# EAGLE design DME_Board_1 (EAGLE 7.2.0)
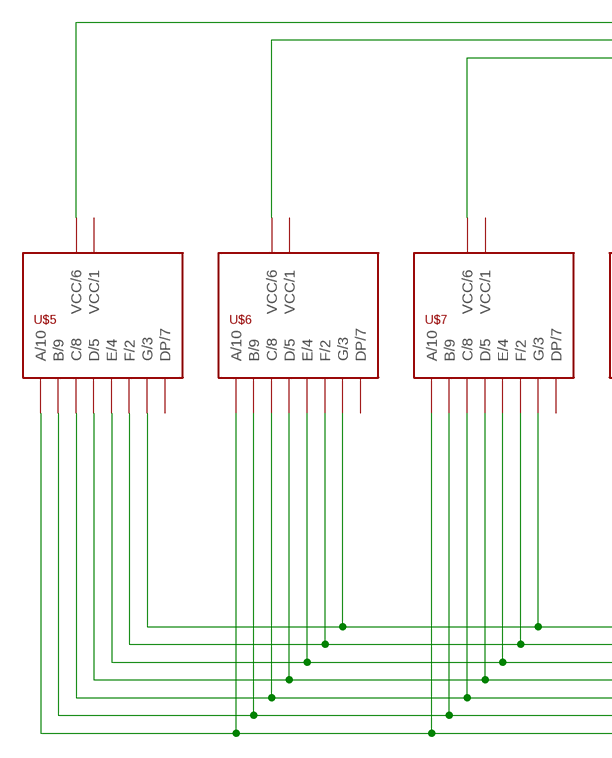
[diagram p0: schematic, sheet 1, part 1 of 2]
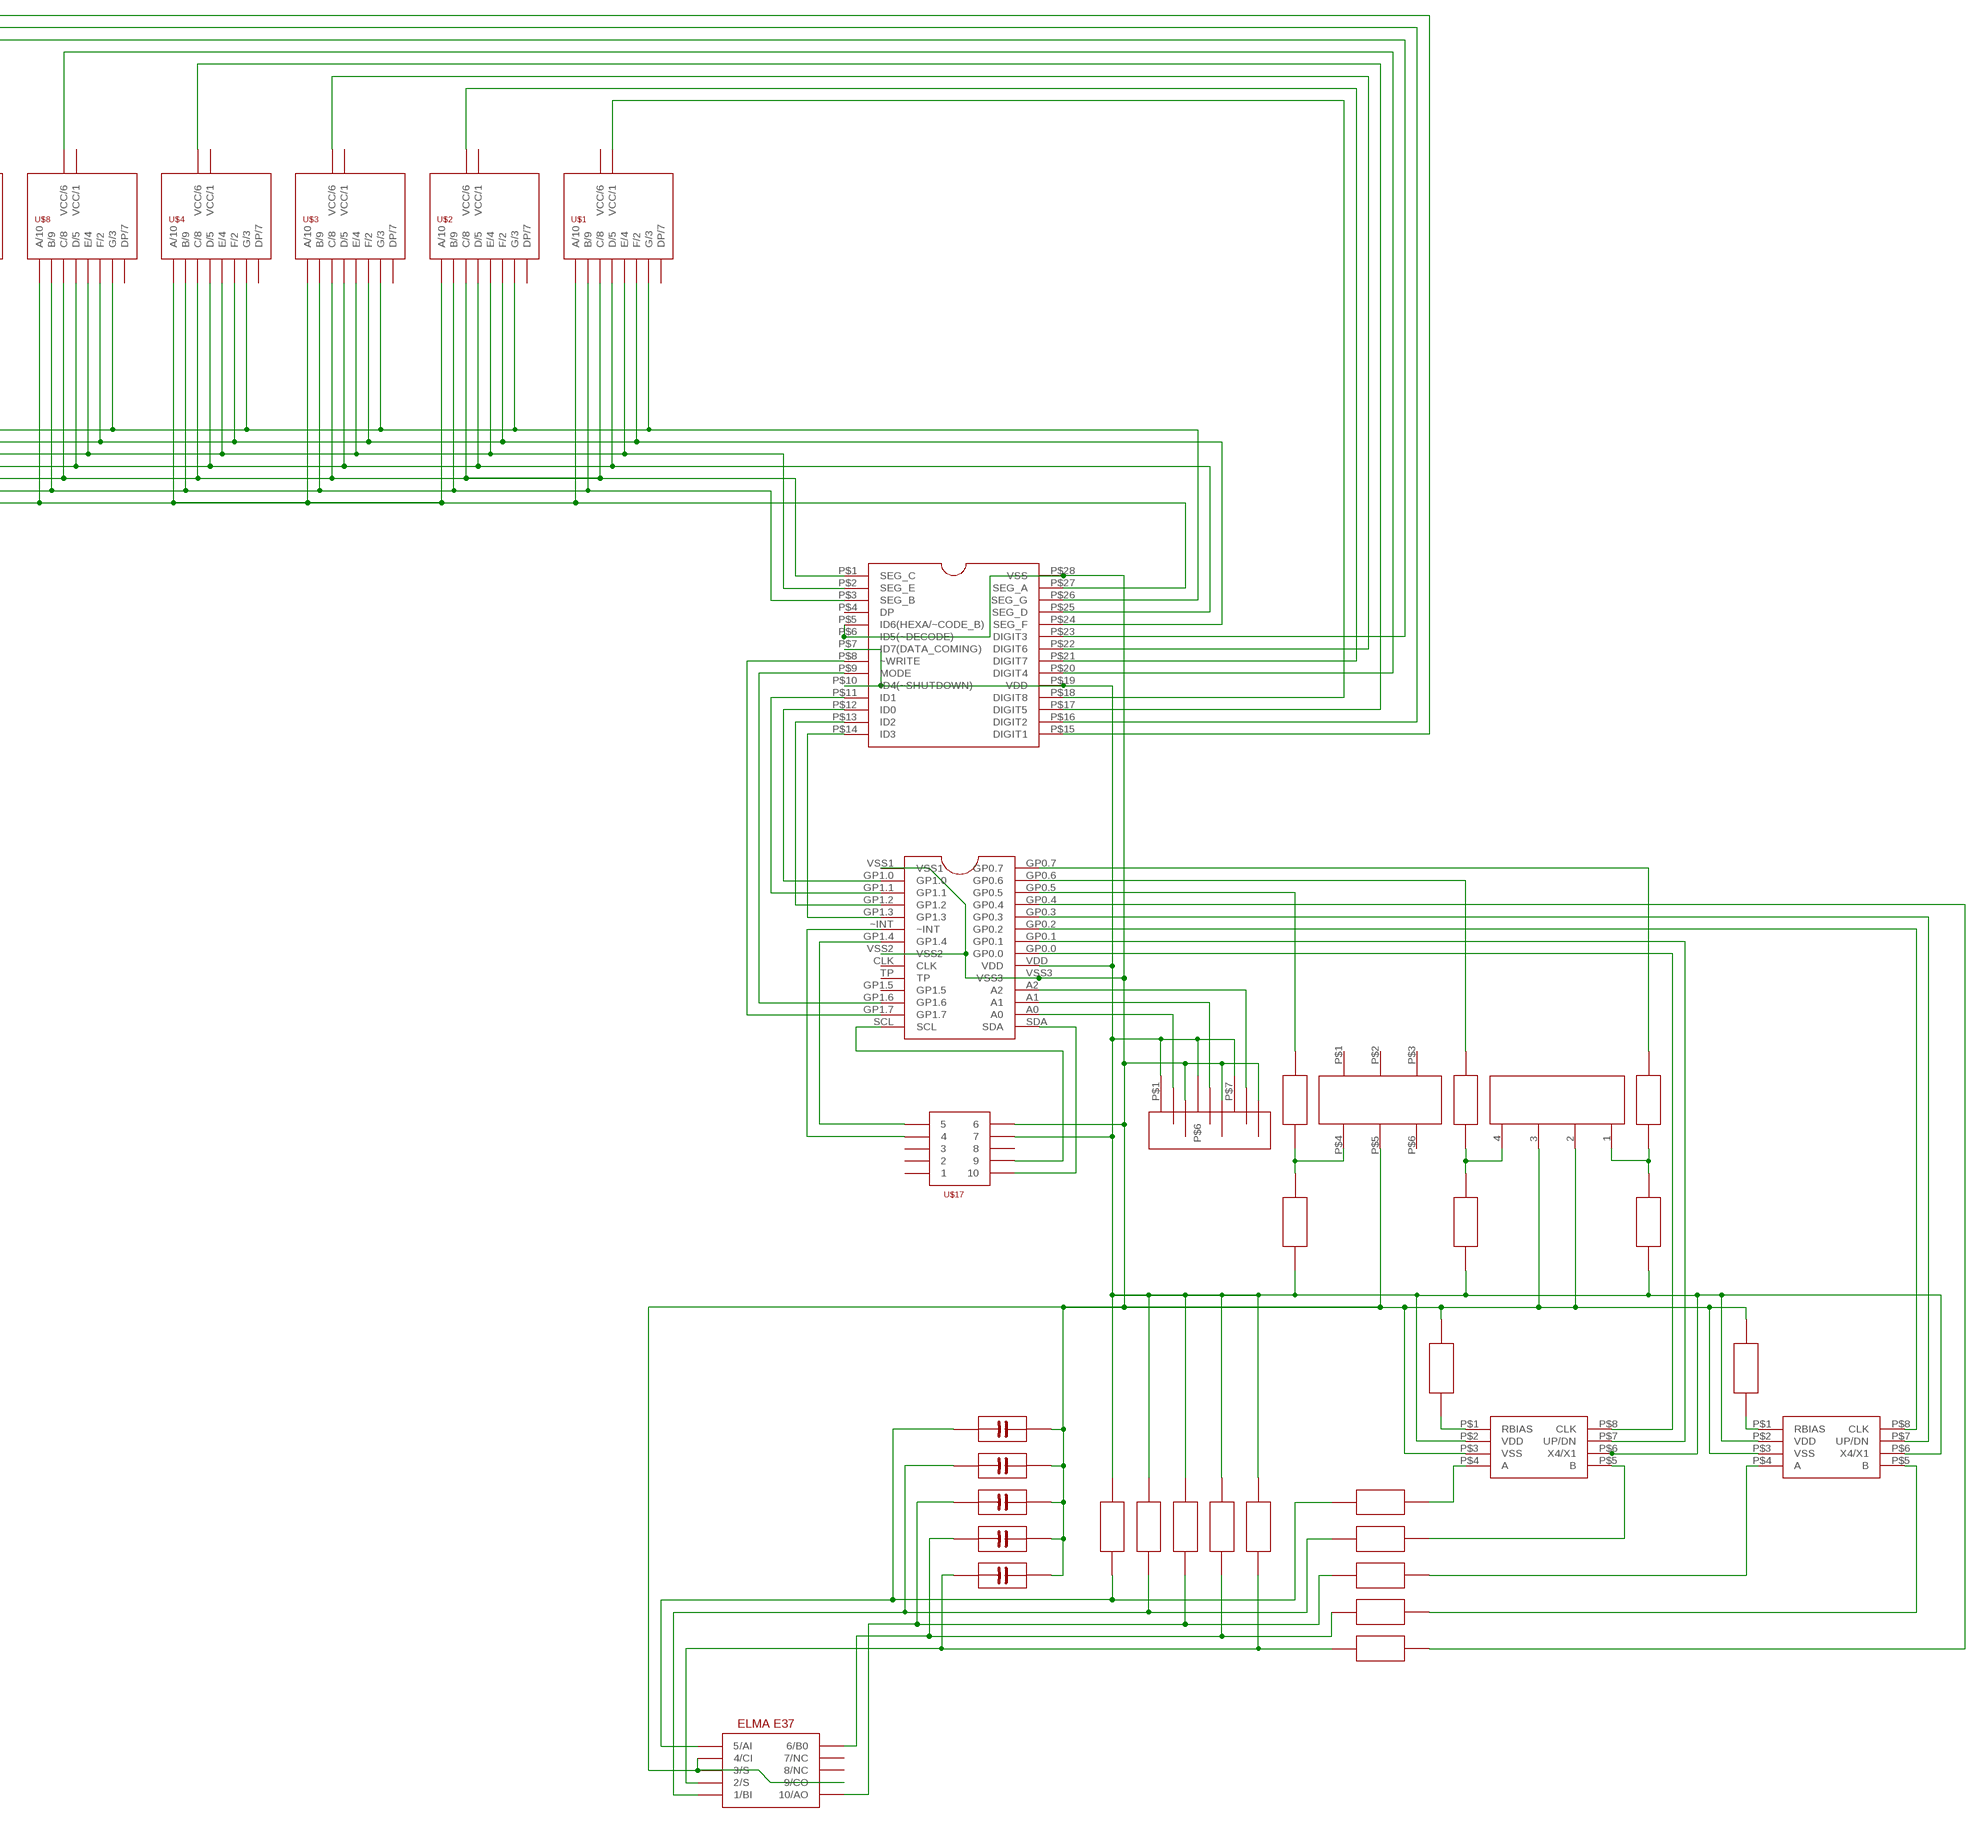
[diagram p1: schematic, sheet 1, part 2 of 2]

## Parts
U$1  SA3611EWA  [SA3611EWA]
U$2  SA3611EWA  [SA3611EWA]
U$3  SA3611EWA  [SA3611EWA]
U$4  SA3611EWA  [SA3611EWA]
U$5  SA3611EWA  [SA3611EWA]
U$6  SA3611EWA  [SA3611EWA]
U$7  SA3611EWA  [SA3611EWA]
U$8  SA3611EWA  [SA3611EWA]
U$9  ELMA_E37  [ELMA_E37]
U$10  REZISTOR  [REZISTOR]
U$11  KONDENZATOR  [KONDENZATOR]
U$12  T220  [T220]
U$13  REZISTOR  [REZISTOR]
U$14  ICM7228A  [ICM7228A]
U$15  REZISTOR  [REZISTOR]
U$16  MCP23016  [MCP23016]
U$17  LISTA_2X5  [LISTA_2X5]
U$18  LS7084  [LS7084]
U$19  46311LD  [46311LD]
U$20  REZISTOR  [REZISTOR]
U$21  REZISTOR  [REZISTOR]
U$22  REZISTOR  [REZISTOR]
U$23  REZISTOR  [REZISTOR]
U$24  ADRESA_0..2  [ADRESA_0..2]
U$25  REZISTOR  [REZISTOR]
U$26  REZISTOR  [REZISTOR]
U$27  REZISTOR  [REZISTOR]
U$28  REZISTOR  [REZISTOR]
U$29  REZISTOR  [REZISTOR]
U$30  REZISTOR  [REZISTOR]
U$31  REZISTOR  [REZISTOR]
U$32  REZISTOR  [REZISTOR]
U$33  REZISTOR  [REZISTOR]
U$34  REZISTOR  [REZISTOR]
U$35  REZISTOR  [REZISTOR]
U$42  KONDENZATOR  [KONDENZATOR]
U$43  KONDENZATOR  [KONDENZATOR]
U$44  KONDENZATOR  [KONDENZATOR]
U$45  103  KONDENZATOR  [KONDENZATOR]
U$46  LS7084  [LS7084]

## Nets
N$1: U$1.10(A/10) U$2.10(A/10) U$3.10(A/10) U$4.10(A/10) U$5.10(A/10) U$6.10(A/10) U$7.10(A/10) U$8.10(A/10) U$14.P$27(SEG_A)
N$2: U$1.9(B/9) U$2.9(B/9) U$3.9(B/9) U$4.9(B/9) U$5.9(B/9) U$6.9(B/9) U$7.9(B/9) U$8.9(B/9) U$14.P$3(SEG_B)
N$3: U$1.8(C/8) U$2.8(C/8) U$3.8(C/8) U$4.8(C/8) U$5.8(C/8) U$6.8(C/8) U$7.8(C/8) U$8.8(C/8) U$14.P$1(SEG_C)
N$4: U$1.5(D/5) U$2.5(D/5) U$3.5(D/5) U$4.5(D/5) U$5.5(D/5) U$6.5(D/5) U$7.5(D/5) U$8.5(D/5) U$14.P$25(SEG_D)
N$5: U$5.6(VCC/6) U$14.P$15(DIGIT1)
N$6: U$1.2(F/2) U$2.2(F/2) U$3.2(F/2) U$4.2(F/2) U$5.2(F/2) U$6.2(F/2) U$7.2(F/2) U$8.2(F/2) U$14.P$24(SEG_F)
N$7: U$1.3(G/3) U$2.3(G/3) U$3.3(G/3) U$4.3(G/3) U$5.3(G/3) U$6.3(G/3) U$7.3(G/3) U$8.3(G/3) U$14.P$26(SEG_G)
N$8: U$6.6(VCC/6) U$14.P$16(DIGIT2)
N$9: U$1.4(E/4) U$2.4(E/4) U$3.4(E/4) U$4.4(E/4) U$5.4(E/4) U$6.4(E/4) U$7.4(E/4) U$8.4(E/4) U$14.P$2(SEG_E)
N$10: U$7.6(VCC/6) U$14.P$23(DIGIT3)
N$11: U$8.6(VCC/6) U$14.P$20(DIGIT4)
N$12: U$1.1(VCC/1) U$14.P$18(DIGIT8)
N$13: U$2.6(VCC/6) U$14.P$21(DIGIT7)
N$14: U$3.6(VCC/6) U$14.P$22(DIGIT6)
N$15: U$4.6(VCC/6) U$14.P$17(DIGIT5)
N$16: U$16.GP0.5 U$23.P$2
N$17: U$9.1(1/BI) U$11.P$1 U$25.P$1 U$32.P$2
N$18: U$14.P$12(ID0) U$16.GP1.0
N$19: U$14.P$11(ID1) U$16.GP1.1
N$20: U$14.P$13(ID2) U$16.GP1.2
N$21: U$14.P$14(ID3) U$16.GP1.3
N$22: U$14.P$9(MODE) U$16.GP1.6
N$23: U$14.P$8(~WRITE) U$16.GP1.7
N$24: U$16.A0 U$24.P$2
N$25: U$10.P$1 U$13.P$1 U$14.P$7(ID7(DATA_COMING)) U$14.P$10(ID4(~SHUTDOWN)) U$14.P$19(VDD) U$15.P$1 U$16.VDD U$17.7 U$18.P$2(VDD) U$18.P$6(X4/X1) U$20.P$2 U$24.P$1 U$24.P$6 U$24.P$7 U$25.P$2 U$26.P$2 U$27.P$2 U$28.P$2 U$46.P$2(VDD) U$46.P$6(X4/X1)
N$26: U$31.P$1 U$46.P$4(A)
N$27: U$30.P$1 U$46.P$5(B)
N$28: U$9.10(10/AO) U$26.P$1 U$31.P$2 U$43.P$1
N$29: U$9.2(2/S) U$28.P$1 U$29.P$2 U$45.P$1
N$30: U$9.6(6/B0) U$27.P$1 U$30.P$2 U$44.P$1
N$31: U$16.GP0.4 U$29.P$1
N$32: U$18.P$4(A) U$33.P$1
N$33: U$16.A1 U$24.P$5
N$34: U$35.P$1 U$46.P$1(RBIAS)
N$35: U$18.P$5(B) U$32.P$1
N$36: U$18.P$1(RBIAS) U$34.P$1
N$37: U$16.GP0.1 U$18.P$7(UP/DN)
N$38: U$16.GP0.0 U$18.P$8(CLK)
N$39: U$16.GP0.3 U$46.P$7(UP/DN)
N$40: U$16.GP0.2 U$46.P$8(CLK)
N$41: U$9.5(5/AI) U$20.P$1 U$33.P$2 U$42.P$1
N$42: U$16.A2 U$24.P$8
N$43: U$10.P$2 U$12.P$4 U$23.P$1
N$44: U$9.3(3/S) U$9.4(4/CI) U$9.9(9/CO) U$11.P$2 U$12.P$5 U$14.P$5(ID6(HEXA/~CODE_B)) U$14.P$6(ID5(~DECODE)) U$14.P$28(VSS) U$16.VSS1 U$16.VSS2 U$16.VSS3 U$17.6 U$18.P$3(VSS) U$19.2 U$19.3 U$24.P$3 U$24.P$4 U$24.P$9 U$34.P$2 U$35.P$2 U$42.P$2 U$43.P$2 U$44.P$2 U$45.P$2 U$46.P$3(VSS)
N$45: U$13.P$2 U$19.4 U$22.P$1
N$46: U$15.P$2 U$19.1 U$21.P$1
N$47: U$16.GP0.6 U$22.P$2
N$48: U$16.GP0.7 U$21.P$2
N$49: U$16.SDA U$17.10
N$50: U$16.SCL U$17.9
N$51: U$16.GP1.4 U$17.5
N$52: U$16.~INT U$17.4
Unconnected: U$1.6(VCC/6) U$1.7(DP/7) U$2.1(VCC/1) U$2.7(DP/7) U$3.1(VCC/1) U$3.7(DP/7) U$4.1(VCC/1) U$4.7(DP/7) U$5.1(VCC/1) U$5.7(DP/7) U$6.1(VCC/1) U$6.7(DP/7) U$7.1(VCC/1) U$7.7(DP/7) U$8.1(VCC/1) U$8.7(DP/7) U$9.7(7/NC) U$9.8(8/NC) U$12.P$1 U$12.P$2 U$12.P$3 U$12.P$6 U$14.P$4(DP) U$16.CLK U$16.GP1.5 U$16.TP U$17.1 U$17.2 U$17.3 U$17.8

## Library data of the parts
U$1-U$8 = library:SA3611EWA
U$9 = library:ELMA_E37
U$10 U$13 U$15 U$20-U$23 U$25-U$35 = library:REZISTOR
U$11 U$42-U$45 = library:KONDENZATOR
U$12 = library:T220
U$14 = library:ICM7228A
U$16 = library:MCP23016
U$17 = library:LISTA_2X5
U$18 U$46 = library:LS7084
U$19 = library:46311LD
U$24 = library:ADRESA_0..2

## Board
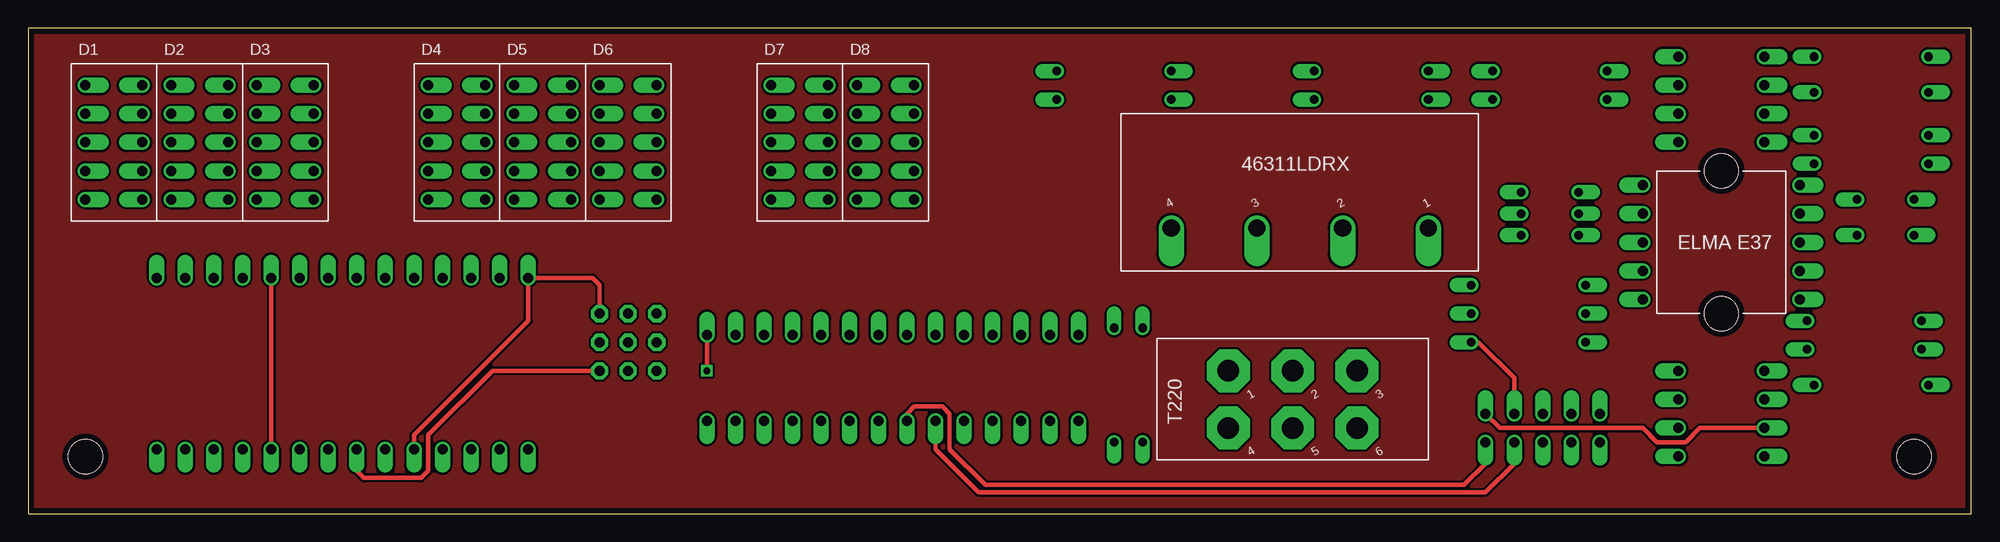
[diagram p2: board, top side]
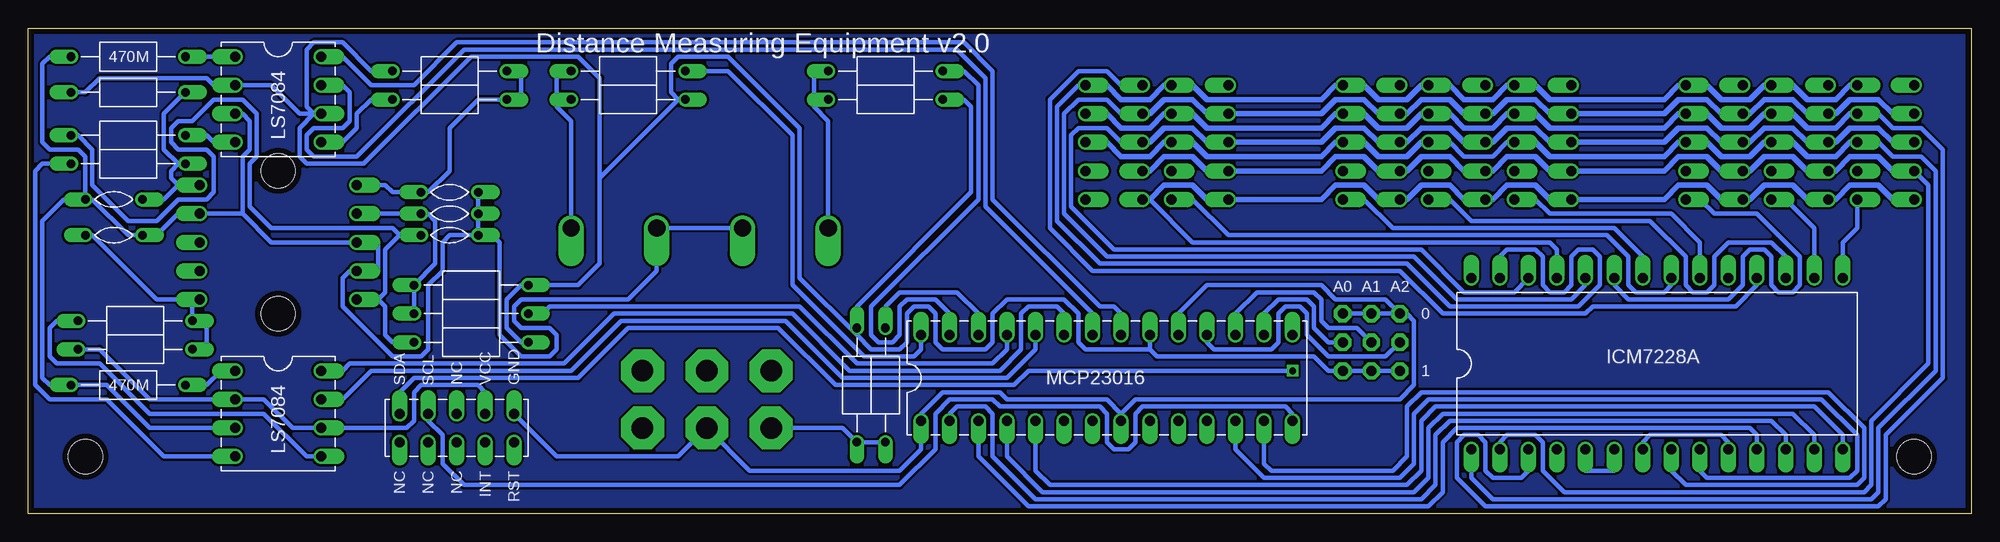
[diagram p3: board, bottom side, seen from below]

Size 172.72 x 43.18 mm. Coordinates in mm from the lower left corner, seen from the top.
Outline: 0,43.18 0,0 172.72,0 172.72,43.18 0,43.18
Copper layers (1*16): Top 0.035mm / dielectric 1.5mm / Bottom 0.035mm
Design rules "RadioStack_v2": minimum track width 0.2mm, minimum drill 0.4mm, track to track 0.2mm, track to pad 0.2mm, pad to pad 0.2mm, via to via 0.2mm, smd to smd 0.2mm, copper to edge 0.5mm, drill to drill 8mil, minimum pad ring 10mil, minimum via ring 8mil, stop-mask expansion 4mil, vias tented up to drill 0mil, thermal gap 10mil
Holes 3.05 mm at 167.64,5.08 5.08,5.08

### Footprints (pad centres in the part's own frame; a part is rotated, then mirrored left to right if it is on the bottom)
SA3611EWA = drill 0.889 pad 1.27 offset: 1 0,0; 2 0,-2.54; 3 0,-5.08; 4 0,-7.62; 5 0,-10.16; 6 5.08,-10.16; 7 5.08,-7.62; 8 5.08,-5.08; 9 5.08,-2.54; 10 5.08,0
ELMA_E37 = drill 0.889 pad 1.27 offset: 1 0,0; 2 0,-2.54; 3 0,-5.08; 4 0,-7.62; 5 0,-10.16; 6 13.97,-10.16; 7 13.97,-7.62; 8 13.97,-5.08; 9 13.97,-2.54; 10 13.97,0 | hole 3.048: 6.985,1.27; 6.985,-11.43
REZISTOR = drill 0.762 pad 1.27 offset: P$1 -5.08,0; P$2 5.08,0
KONDENZATOR = drill 0.762 pad 1.27 offset: P$1 -2.54,0; P$2 2.54,0
T220 = drill 1.905 pad 3.81 octagon: P$1 0,5.08; P$2 5.715,5.08; P$3 11.43,5.08; P$4 0,0; P$5 5.715,0; P$6 11.43,0
ICM7228A = drill 0.889 pad 1.27 offset: P$1 0,0; P$2 0,-2.54 | drill 0.889 offset: P$3 0,-5.08; P$4 0,-7.62; P$5 0,-10.16; P$6 0,-12.7; P$7 0,-15.24; P$8 0,-17.78; P$9 0,-20.32; P$10 0,-22.86; P$11 0,-25.4; P$12 0,-27.94; P$13 0,-30.48; P$14 0,-33.02; P$15 15.24,-33.02; P$16 15.24,-30.48; P$17 15.24,-27.94; P$18 15.24,-25.4; P$19 15.24,-22.86; P$20 15.24,-20.32; P$21 15.24,-17.78; P$22 15.24,-15.24; P$23 15.24,-12.7; P$24 15.24,-10.16; P$25 15.24,-7.62; P$26 15.24,-5.08; P$27 15.24,-2.54; P$28 15.24,0
MCP23016 = drill 0.889 pad 1.27 offset: A0 7.62,-30.48; A1 7.62,-27.94; A2 7.62,-25.4; CLK 0,-20.32; GP0.0 7.62,-17.78; GP0.1 7.62,-15.24; GP0.2 7.62,-12.7; GP0.3 7.62,-10.16; GP0.4 7.62,-7.62; GP0.5 7.62,-5.08; GP0.6 7.62,-2.54; GP0.7 7.62,0; GP1.0 0,-2.54; GP1.1 0,-5.08; GP1.2 0,-7.62; GP1.3 0,-10.16; GP1.4 0,-15.24; GP1.5 0,-25.4; GP1.6 0,-27.94; GP1.7 0,-30.48; SCL 0,-33.02; SDA 7.62,-33.02; TP 0,-22.86; VDD 7.62,-20.32; VSS1 0,0; VSS2 0,-17.78; VSS3 7.62,-22.86; ~INT 0,-12.7
LISTA_2X5 = drill 0.889 pad 1.27 offset: 1 0,0; 2 0,-2.54; 3 0,-5.08; 4 0,-7.62; 5 0,-10.16; 6 2.54,-10.16; 7 2.54,-7.62; 8 2.54,-5.08; 9 2.54,-2.54; 10 2.54,0
LS7084 = drill 0.889 pad 1.27 offset: P$1 0,0; P$2 0,-2.54; P$3 0,-5.08; P$4 0,-7.62; P$5 7.62,-7.62; P$6 7.62,-5.08; P$7 7.62,-2.54; P$8 7.62,0
46311LD = drill 1.524 pad 2.286 offset: 1 0,0; 2 7.62,0; 3 15.24,0; 4 22.86,0
ADRESA_0..2 = drill 0.889 pad 1.524 octagon: P$1 0,0; P$2 0,-2.54; P$3 0,-5.08; P$4 2.54,-5.08; P$5 2.54,-2.54; P$6 2.54,0; P$7 5.08,0; P$8 5.08,-2.54; P$9 5.08,-5.08

### Placement (x,y rotation side)
U$1  73.66,38.1 0 top
U$2  66.04,38.1 0 top
U$3  50.8,38.1 0 top
U$4  43.18,38.1 0 top
U$5  5.08,38.1 0 top
U$6  12.7,38.1 0 top
U$7  20.32,38.1 0 top
U$8  35.56,38.1 0 top
U$9  143.51,29.21 0 top
U$10  99.06,11.43 270 bottom
U$11  135.25,28.57 0 bottom
U$12  106.68,7.62 0 top
U$13  96.52,36.83 180 bottom
U$14  44.45,5.71 90 bottom
U$15  119.38,36.83 180 bottom
U$16  93.34,8.26 90 bottom
U$17  139.7,6.35 90 bottom
U$18  154.31,40.64 0 bottom
U$19  124.46,25.4 180 top
U$20  133.35,15.24 0 bottom
U$21  119.38,39.37 0 bottom
U$22  96.52,39.37 0 bottom
U$23  96.52,11.43 90 bottom
U$24  55.88,12.7 180 top
U$25  135.25,39.37 180 bottom
U$26  163.83,37.47 180 bottom
U$27  163.19,14.61 180 bottom
U$28  133.35,20.32 0 bottom
U$29  133.35,17.78 180 bottom
U$30  163.19,17.14 0 bottom
U$31  163.83,31.12 0 bottom
U$32  135.25,36.83 0 bottom
U$33  163.83,33.66 180 bottom
U$34  163.83,40.64 180 bottom
U$35  163.83,11.43 180 bottom
U$42  135.25,24.77 0 bottom
U$43  165.1,27.94 180 bottom
U$44  165.1,24.77 0 bottom
U$45  135.25,26.67 0 bottom
U$46  154.31,12.7 0 bottom

### Tracks (layer width: path | path; a pad name or v marks a point on that pad's centre or on a via)
N$1
  Bottom 0.406: U$14.P$27 41.91,22.86 41.27,23.5 38.73,23.5 38.1,22.86 38.1,20.32 37.47,19.68 36.2,19.68 35.56,20.32 35.56,22.86 34.92,23.5 33.66,23.5 33.02,22.86 33.02,20.32 34.92,18.41 46.35,18.41 50.16,22.23 77.47,22.23 81.28,26.04 81.28,36.2 79.38,38.1 U$1.10
  Bottom 0.508: U$5.10 10.79,38.1 12.06,36.83 14.61,36.83 15.88,38.1 U$6.10 18.41,38.1 19.68,36.83 22.23,36.83 23.5,38.1 U$7.10 26.04,38.1 27.3,36.83 37.47,36.83 38.73,38.1 U$8.10 41.27,38.1 42.55,36.83 45.09,36.83 46.35,38.1 U$4.10 48.9,38.1 50.16,36.83 52.7,36.83 53.98,38.1 U$3.10 56.52,38.1 57.78,36.83 67.94,36.83 69.22,38.1 U$2.10 71.75,38.1 73.03,36.83 75.56,36.83 76.83,38.1 U$1.10
N$2
  Bottom 0.406: U$14.P$3 39.37,3.81 40.01,3.17 42.55,3.17 43.18,3.81 43.18,6.35 43.81,6.98 45.09,6.98 45.72,6.35 45.72,3.17 43.18,0.63 8.26,0.63 7.62,1.27 7.62,6.98 2.54,12.07 2.54,32.38 4.45,34.29 6.99,34.29 8.26,35.56 U$5.9
  Bottom 0.508: U$5.9 10.79,35.56 12.06,34.29 14.61,34.29 15.88,35.56 U$6.9 18.41,35.56 19.68,34.29 22.23,34.29 23.5,35.56 U$7.9 26.04,35.56 27.3,34.29 37.47,34.29 38.73,35.56 U$8.9 41.27,35.56 42.55,34.29 45.09,34.29 46.35,35.56 U$4.9 48.9,35.56 50.16,34.29 52.7,34.29 53.98,35.56 U$3.9 56.52,35.56 57.78,34.29 67.94,34.29 69.22,35.56 U$2.9 71.75,35.56 73.03,34.29 75.56,34.29 76.83,35.56 U$1.9
N$3
  Bottom 0.406: U$14.P$1 44.45,3.17 42.55,1.27 8.89,1.27 8.26,1.91 8.26,7.62 3.17,12.7 3.17,30.48 4.45,31.75 6.99,31.75 8.26,33.02 U$5.8 | U$8.8 41.27,33.02 42.55,31.75 45.09,31.75 46.35,33.02 U$4.8
  Bottom 0.508: U$5.8 10.79,33.02 12.06,31.75 14.61,31.75 15.88,33.02 U$6.8 18.41,33.02 19.68,31.75 22.23,31.75 23.5,33.02 U$7.8 26.04,33.02 27.3,31.75 37.47,31.75 38.73,33.02 U$8.8 | U$4.8 48.9,33.02 50.16,31.75 52.7,31.75 53.98,33.02 U$3.8 56.52,33.02 57.78,31.75 67.94,31.75 69.22,33.02 U$2.8 71.75,33.02 73.03,31.75 75.56,31.75 76.83,33.02 U$1.8
N$4
  Bottom 0.406: U$14.P$25 36.83,23.5 37.47,24.13 69.22,24.13 73.03,27.94
  Bottom 0.508: U$5.5 6.99,27.94 8.26,29.21 10.79,29.21 12.06,27.94 U$6.5 14.61,27.94 15.88,29.21 18.41,29.21 19.68,27.94 U$7.5 22.23,27.94 23.5,29.21 26.04,29.21 27.3,27.94 U$8.5 37.47,27.94 38.73,29.21 41.27,29.21 42.55,27.94 U$4.5 45.09,27.94 46.35,29.21 48.9,29.21 50.16,27.94 U$3.5 52.7,27.94 53.98,29.21 56.52,29.21 57.78,27.94 U$2.5 67.94,27.94 69.22,29.21 71.75,29.21 73.03,27.94 U$1.5
N$5
  Bottom 0.406: U$5.6 10.16,25.4 11.43,24.13 U$14.P$15
N$6
  Bottom 0.406: U$14.P$24 34.29,20.32 35.56,19.05 45.72,19.05 49.53,22.86 76.83,22.86 80.64,26.67 80.64,35.56 79.38,36.83 76.83,36.83 75.56,35.56 U$1.2
  Bottom 0.508: U$5.2 6.99,35.56 8.26,36.83 10.79,36.83 12.06,35.56 U$6.2 14.61,35.56 15.88,36.83 18.41,36.83 19.68,35.56 U$7.2 22.23,35.56 23.5,36.83 26.04,36.83 27.3,35.56 U$8.2 37.47,35.56 38.73,36.83 41.27,36.83 42.55,35.56 U$4.2 45.09,35.56 46.35,36.83 48.9,36.83 50.16,35.56 U$3.2 52.7,35.56 53.98,36.83 56.52,36.83 57.78,35.56 U$2.2 67.94,35.56 69.22,36.83 71.75,36.83 73.03,35.56 U$1.2
N$7
  Bottom 0.406: U$14.P$26 40.64,19.68 45.09,19.68 48.9,23.5 76.2,23.5 80.01,27.3 80.01,33.66 79.38,34.29 76.83,34.29 75.56,33.02 U$1.3
  Bottom 0.508: U$5.3 6.99,33.02 8.26,34.29 10.79,34.29 12.06,33.02 U$6.3 14.61,33.02 15.88,34.29 18.41,34.29 19.68,33.02 U$7.3 22.23,33.02 23.5,34.29 26.04,34.29 27.3,33.02 U$8.3 37.47,33.02 38.73,34.29 41.27,34.29 42.55,33.02 U$4.3 45.09,33.02 46.35,34.29 48.9,34.29 50.16,33.02 U$3.3 52.7,33.02 53.98,34.29 56.52,34.29 57.78,33.02 U$2.3 67.94,33.02 69.22,34.29 71.75,34.29 73.03,33.02 U$1.3
N$8
  Bottom 0.406: U$6.6 16.51,27.94 13.97,25.4 U$14.P$16
N$9
  Bottom 0.406: U$14.P$2 41.91,6.35 41.27,6.98 38.73,6.98 38.1,6.35 38.1,3.81 36.2,1.91 9.53,1.91 8.89,2.54 8.89,8.26 3.81,13.34 3.81,29.21 U$5.4
  Bottom 0.508: U$5.4 6.99,30.48 8.26,31.75 10.79,31.75 12.06,30.48 U$6.4 14.61,30.48 15.88,31.75 18.41,31.75 19.68,30.48 U$7.4 22.23,30.48 23.5,31.75 26.04,31.75 27.3,30.48 U$8.4 37.47,30.48 38.73,31.75 41.27,31.75 42.55,30.48 U$4.4 45.09,30.48 46.35,31.75 48.9,31.75 50.16,30.48 U$3.4 52.7,30.48 53.98,31.75 56.52,31.75 57.78,30.48 U$2.4 67.94,30.48 69.22,31.75 71.75,31.75 73.03,30.48 U$1.4
N$10
  Bottom 0.406: U$7.6 24.13,27.94 22.86,26.67 19.05,26.67 15.24,22.86 15.24,20.32 15.88,19.68 17.14,19.68 17.78,20.32 17.78,22.86 18.41,23.5 19.68,23.5 20.32,22.86 20.32,20.32 21.59,19.05 30.48,19.05 31.75,20.32 U$14.P$23
N$11
  Bottom 0.406: U$14.P$20 24.13,24.13 26.67,26.67 37.47,26.67 38.73,27.94 U$8.6
N$12
  Bottom 0.406: U$1.1 75.56,38.1 76.83,39.37 79.38,39.37 81.92,36.83 81.92,25.4 78.11,21.59 50.8,21.59 46.99,17.78 34.29,17.78 33.66,18.41 20.95,18.41 19.05,20.32 U$14.P$18
N$13
  Bottom 0.406: U$14.P$21 26.67,20.32 27.3,19.68 29.84,19.68 30.48,20.32 30.48,22.86 32.38,24.77 66.04,24.77 69.22,27.94 U$2.6
N$14
  Bottom 0.406: U$14.P$22 29.21,22.86 31.75,25.4 51.44,25.4 53.98,27.94 U$3.6
N$15
  Bottom 0.406: U$4.6 46.35,27.94 44.45,26.04 28.57,26.04 25.4,22.86 25.4,20.32 24.77,19.68 23.5,19.68 22.86,20.32 22.86,22.86 21.59,24.13 17.78,24.13 16.51,22.86 U$14.P$17
N$16
  Bottom 0.406: U$16.GP0.5 88.27,17.78 90.17,19.68 95.25,19.68 96.52,18.41 U$23.P$2
N$17
  Bottom 0.406: U$25.P$1 128.91,39.37 128.91,36.83 U$32.P$2 132.72,36.83 135.25,34.29 135.25,30.48 137.16,28.57 U$11.P$1 140.34,28.57 140.97,29.21 U$9.1
N$18
  Bottom 0.406: U$14.P$12 16.51,6.98 17.78,8.26 46.35,8.26 47.62,6.98 47.62,2.54 48.9,1.27 83.19,1.27 87,5.08 87,8.89 87.63,9.52 90.17,9.52 90.81,8.89 U$16.GP1.0
N$19
  Bottom 0.406: U$14.P$11 19.05,6.98 19.68,7.62 45.72,7.62 46.99,6.35 46.99,1.91 48.26,0.63 83.82,0.63 88.27,5.08 U$16.GP1.1
N$20
  Bottom 0.406: U$14.P$13 13.97,6.98 15.88,8.89 46.99,8.89 48.26,7.62 48.26,3.17 49.53,1.91 82.55,1.91 85.72,5.08 U$16.GP1.2
N$21
  Bottom 0.406: U$14.P$14 11.43,6.98 13.97,9.52 47.62,9.52 48.9,8.26 48.9,3.81 50.16,2.54 81.92,2.54 83.19,3.81 U$16.GP1.3
N$22
  Bottom 0.406: U$14.P$9 24.13,3.81 23.5,3.17 10.79,3.17 10.16,3.81 10.16,6.98 13.34,10.16 48.26,10.16 49.53,8.89 49.53,4.45 50.8,3.17 62.87,3.17 65.41,5.71 U$16.GP1.6
N$23
  Bottom 0.406: U$14.P$8 26.67,3.81 25.4,2.54 10.16,2.54 9.53,3.17 9.53,7.62 12.7,10.8 48.9,10.8 50.16,9.52 50.16,5.08 51.44,3.81 62.23,3.81 62.87,4.45 U$16.GP1.7
N$24
  Bottom 0.406: U$24.P$2 57.15,15.24 58.42,16.51 58.42,18.41 59.05,19.05 61.59,19.05 62.87,17.78 U$16.A0
N$25
  Top 0.406: U$14.P$19 U$14.P$10 | U$24.P$7 41.27,12.7 35.56,6.98 35.56,3.81 34.92,3.17 29.84,3.17 29.21,3.81 U$14.P$7 | U$17.7 132.08,12.07 128.91,15.24 U$20.P$2
  Bottom 0.406: U$24.P$7 U$24.P$6 U$24.P$1 57.15,12.7 58.42,13.97 72.39,13.97 73.03,14.61 | U$14.P$10 21.59,6.35 22.23,6.98 28.57,6.98 29.21,6.35 U$14.P$7 | U$13.P$1 89.53,36.83 88.9,36.2 88.9,28.57 99.06,18.41 U$10.P$1 99.06,15.88 | U$20.P$2 128.91,15.24 130.18,16.51 130.18,19.05 128.91,20.32 U$28.P$2 123.83,20.32 121.92,22.23 121.92,29.84 | 99.06,15.88 104.14,20.95 104.14,34.29 110.49,40.64 114.94,40.64 115.57,40.01 115.57,37.47 114.94,36.83 | U$18.P$6 147.32,35.56 | 147.32,35.56 148.59,35.56 151.13,38.1 U$18.P$2 156.21,38.1 156.84,38.73 166.37,38.73 167.64,37.47 U$26.P$2 | 121.92,29.84 114.94,36.83 | 114.94,36.83 U$15.P$1 | U$25.P$2 142.24,39.37 144.78,41.91 147.32,41.91 147.96,41.27 147.96,36.2 147.32,35.56 | U$27.P$2 166.37,14.61 161.93,10.16 U$46.P$2 151.76,10.16 149.22,7.62 U$46.P$6 139.06,7.62 138.43,8.26 138.43,10.8 137.79,11.43 132.72,11.43 132.08,10.8 U$17.7 | U$16.VDD 73.03,14.61 | 73.03,14.61 78.74,14.61 79.38,15.24 79.38,17.78 80.64,19.05 85.72,19.05 87,17.78 87,15.24 87.63,14.61 91.44,14.61 92.08,15.24 92.08,17.78 92.71,18.41 93.98,18.41 94.61,17.78 94.61,15.24 95.25,14.61 97.79,14.61 99.06,15.88 | 121.92,29.84 121.92,38.73 123.83,40.64 133.35,40.64 142.88,31.12 147.96,31.12 148.59,31.75 148.59,34.29 147.32,35.56
N$26
  Bottom 0.406: U$31.P$1 171.45,31.12 172.09,30.48 172.09,11.43 170.81,10.16 165.74,10.16 160.66,5.08 U$46.P$4
N$27
  Bottom 0.406: U$30.P$1 170.18,17.14 170.81,16.51 170.81,13.97 170.18,13.34 166.37,13.34 161.93,8.89 151.76,8.89 147.96,5.08 U$46.P$5
N$28
  Bottom 0.406: U$26.P$1 160.66,35.56 160.66,32.38 159.38,31.12 | 159.38,31.12 U$31.P$2 | U$9.10 159.38,29.21 | 159.38,29.21 160.02,29.84 160.02,30.48 159.38,31.12 | U$43.P$1 160.66,27.94 159.38,29.21
N$29
  Bottom 0.406: U$29.P$2 U$28.P$1 136.53,22.23 136.53,26.04 137.16,26.67 U$45.P$1 U$9.2
N$30
  Bottom 0.406: U$27.P$1 157.48,14.61 156.84,15.24 156.84,16.51 157.48,17.14 U$30.P$2 158.12,19.05 | U$9.6 158.12,19.05 | 158.12,19.05 161.29,19.05 167,24.77 U$44.P$1
N$31
  Bottom 0.406: U$16.GP0.4 85.72,14.61 87,13.34 99.06,13.34 104.14,18.41 126.36,18.41 127,17.78 U$29.P$1
N$32
  Bottom 0.406: U$18.P$4 156.21,33.02 156.84,33.66 U$33.P$1
N$33
  Bottom 0.406: U$24.P$5 54.61,16.51 57.15,16.51 57.78,17.14 57.78,19.05 58.42,19.68 63.5,19.68 65.41,17.78 U$16.A1
N$34
  Bottom 0.406: U$46.P$1 155.57,12.7 156.84,11.43 U$35.P$1
N$35
  Bottom 0.406: U$18.P$5 144.78,33.02 143.51,34.29 143.51,35.56 142.24,36.83 U$32.P$1
N$36
  Bottom 0.406: U$18.P$1 U$34.P$1
N$37
  Bottom 0.406: U$18.P$7 144.78,38.1 144.15,37.47 144.15,34.92 144.78,34.29 147.32,34.29 147.96,33.66 147.96,32.38 147.32,31.75 143.51,31.75 133.99,41.27 90.17,41.27 87.63,38.73 87.63,27.3 78.11,17.78 U$16.GP0.1
N$38
  Bottom 0.406: U$16.GP0.0 75.56,17.78 76.2,18.41 77.47,18.41 87,27.94 87,39.37 89.53,41.91 134.62,41.91 138.43,38.1 142.24,38.1 144.78,40.64 U$18.P$8
N$39
  Bottom 0.406: U$46.P$7 144.78,10.16 142.24,12.7 124.46,12.7 120.02,17.14 105.41,17.14 100.33,12.07 85.72,12.07 83.19,14.61 U$16.GP0.3
N$40
  Bottom 0.406: U$16.GP0.2 80.64,17.78 81.28,18.41 83.82,18.41 84.45,17.78 84.45,14.61 86.36,12.7 99.69,12.7 104.78,17.78 120.65,17.78 125.09,13.34 144.15,13.34 144.78,12.7 U$46.P$8
N$41
  Bottom 0.406: U$42.P$1 139.7,24.77 | 139.7,24.77 140.97,23.5 140.97,19.68 141.6,19.05 | 141.6,19.05 U$9.5 | U$33.P$2 168.28,33.66 167,32.38 167,29.21 163.83,26.04 161.29,26.04 159.38,27.94 156.84,27.94 156.21,28.57 156.21,31.75 156.84,32.38 159.38,32.38 160.02,33.02 160.02,34.29 159.38,34.92 158.12,34.92 156.21,36.83 153.67,36.83 152.4,35.56 152.4,31.75 153.03,31.12 153.03,27.3 151.13,25.4 140.34,25.4 139.7,24.77 | U$20.P$1 140.34,15.24 140.97,15.88 140.97,18.41 141.6,19.05
N$42
  Bottom 0.406: U$24.P$8 52.07,13.97 57.15,13.97 59.05,15.88 59.05,17.78 59.69,18.41 60.96,18.41 61.59,17.78 61.59,15.24 62.23,14.61 67.31,14.61 67.94,15.24 U$16.A2
N$43
  Bottom 0.406: U$23.P$1 U$10.P$2 100.33,7.62 U$12.P$4
N$44
  Top 0.406: U$24.P$9 50.8,20.32 50.16,20.95 U$14.P$28 44.45,17.14 34.29,6.98 U$14.P$5 | U$17.6 130.81,7.62 143.51,7.62 144.78,6.35 147.32,6.35 148.59,7.62 U$46.P$3
  Bottom 0.406: U$24.P$9 U$24.P$4 U$24.P$3 | U$42.P$2 U$45.P$2 U$11.P$2 | 75.56,8.89 74.3,10.16 50.8,10.16 49.53,11.43 49.53,17.14 50.16,17.78 U$24.P$9 | U$16.VSS2 75.56,8.89 | 75.56,8.89 76.83,10.16 85.72,10.16 86.36,10.8 91.44,10.8 93.34,8.89 U$16.VSS1 93.34,5.71 95.25,3.81 108.58,3.81 U$12.P$5 114.94,5.08 125.73,5.08 U$17.6 | U$19.3 U$19.2 116.84,21.59 119.38,19.05 128.91,19.05 129.54,18.41 129.54,17.14 128.91,16.51 126.36,16.51 125.73,15.88 125.73,14.61 126.36,13.97 128.91,13.97 130.81,15.88 130.81,24.13 131.44,24.77 U$42.P$2 | U$14.P$6 31.75,3.81 34.29,3.81 U$14.P$5 | 153.67,26.67 151.13,24.13 U$9.3 141.6,24.13 141.6,21.59 U$9.4 144.15,21.59 144.78,20.95 144.78,18.41 140.34,13.97 137.79,13.97 137.16,14.61 137.16,20.32 135.89,21.59 135.89,24.13 135.25,24.77 U$42.P$2 | 153.67,26.67 U$9.9 159.38,26.67 161.29,24.77 U$44.P$2 163.83,24.77 167,27.94 U$43.P$2 | U$18.P$3 153.67,35.56 153.03,34.92 153.03,32.38 153.67,31.75 153.67,26.67 | U$34.P$2 170.81,40.64 171.45,40.01 171.45,33.02 170.81,32.38 168.28,32.38 167.64,31.75 U$43.P$2 | U$43.P$2 169.54,27.94 171.45,26.04 171.45,12.07 170.81,11.43 U$35.P$2 165.74,11.43 161.93,7.62 U$46.P$3 | U$16.VSS3 70.48,17.78 67.94,20.32 57.78,20.32 56.52,19.05 52.07,19.05 U$24.P$9
N$45
  Bottom 0.406: U$19.4 101.6,34.92 102.87,36.2 102.87,36.83 | U$22.P$1 102.87,39.37 102.87,36.83 | 102.87,36.83 U$13.P$2
N$46
  Bottom 0.406: U$21.P$1 125.73,39.37 125.73,36.83 | U$15.P$2 125.73,36.83 | 125.73,36.83 125.73,36.2 124.46,34.92 U$19.1
N$47
  Bottom 0.406: U$16.GP0.6 90.81,17.78 92.08,19.05 94.61,19.05 95.25,18.41 95.25,15.88 95.89,15.24 97.16,15.24 97.79,15.88 97.79,18.41 88.27,27.94 88.27,38.1 89.53,39.37 U$22.P$2
N$48
  Bottom 0.406: U$21.P$2 110.49,39.37 104.78,33.66 104.78,20.32 98.42,13.97 93.98,13.97 93.34,14.61 U$16.GP0.7
N$49  (via drill 0.6)
  Top 0.406: v60.33,12.7 U$16.SDA
  Bottom 0.406: U$17.10 139.7,10.8 138.43,12.07 123.83,12.07 119.38,16.51 106.05,16.51 100.97,11.43 85.09,11.43 83.82,12.7 v60.33,12.7
N$50
  Bottom 0.406: U$16.SCL 60.33,8.89 60.96,9.52 73.66,9.52 74.3,8.89 74.3,6.35 74.93,5.71 76.2,5.71 76.83,6.35 76.83,8.89 77.47,9.52 86.36,9.52 87,10.16 90.81,10.16 92.08,8.89 92.08,5.71 95.25,2.54 133.99,2.54 135.89,4.45 135.89,6.98 137.16,8.26 U$17.9
N$51
  Top 0.406: U$16.GP1.4 78.11,8.89 78.74,9.52 81.28,9.52 81.92,8.89 81.92,5.71 85.09,2.54 127.64,2.54 129.54,4.45 U$17.5
N$52
  Top 0.406: U$16.~INT 80.64,5.71 84.45,1.91 129.54,1.91 132.08,4.45 U$17.4
N$53
  pour Top: 0.64,42.55 0.64,0.63 172.09,0.63 172.09,42.55
N$54
  pour Bottom: 0.64,42.55 0.64,0.63 172.09,0.63 172.09,42.55

### Text on the board
tPlace: D1 | D2 | D3 | D4 | D5 | D6 | D7 | D8
bPlace: Distance Measuring Equipment v2.0 | 470M | A2 | A1 | A0 | 0 | 1 | GND | VCC | NC | SCL | SDA | 470M | RST | INT | NC | NC | NC